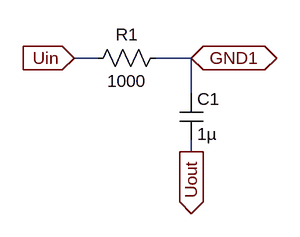
[diagram p0: schematic Draft2.asc]
Draft2.asc, the LTspice schematic file:
Version 4
SHEET 1 880 680
WIRE 80 144 48 144
WIRE 208 144 160 144
WIRE 208 192 208 144
WIRE 208 272 208 256
FLAG 48 144 Uin
IOPIN 48 144 In
FLAG 208 144 GND1
IOPIN 208 144 BiDir
FLAG 208 272 Uout
IOPIN 208 272 Out
SYMBOL res 176 128 R90
WINDOW 0 0 56 VBottom 2
WINDOW 3 32 56 VTop 2
SYMATTR InstName R1
SYMATTR Value 1000
SYMBOL cap 192 192 R0
SYMATTR InstName C1
SYMATTR Value 1µ

The netlist it stands for:
* Draft2.asc
R1 GND1 Uin 1000
C1 GND1 Uout 1µ
.backanno
.end